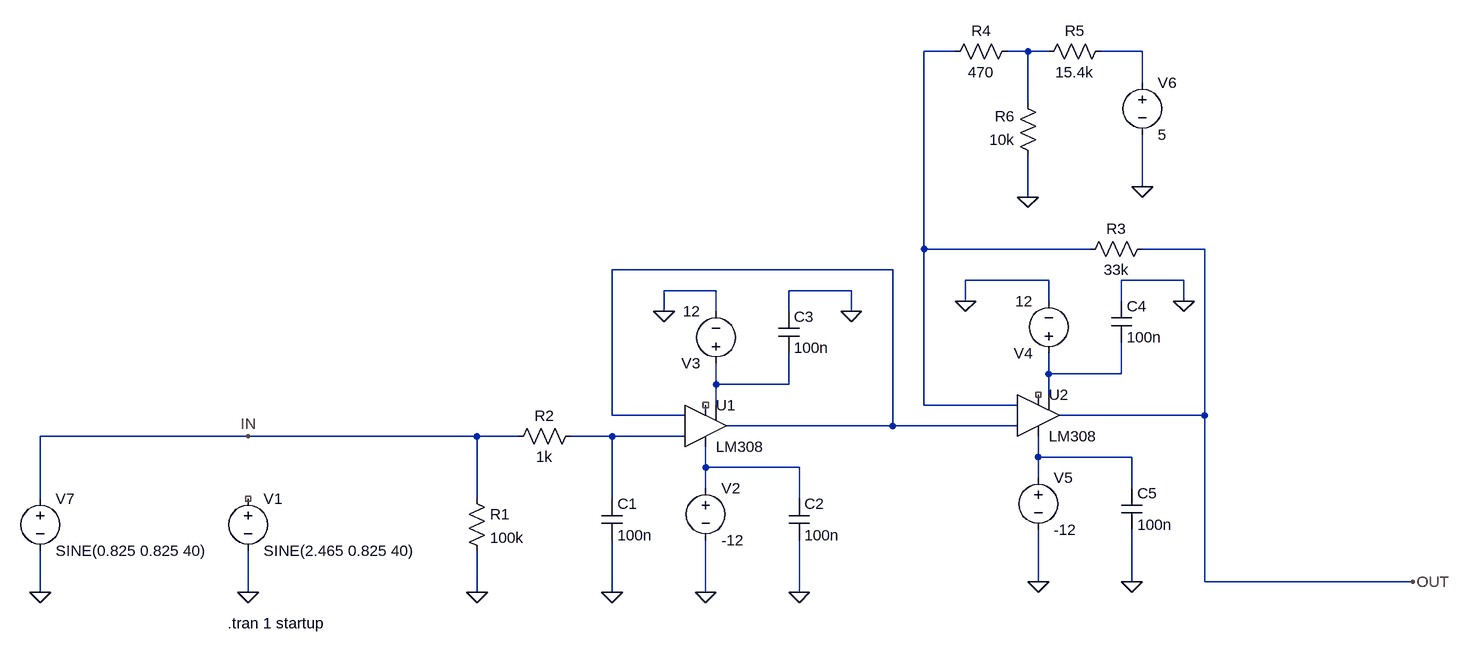
[diagram p0: schematic analog_output.asc]
analog_output.asc, the LTspice schematic file:
Version 4
SHEET 1 1656 680
WIRE 864 -560 816 -560
WIRE 976 -560 944 -560
WIRE 1008 -560 976 -560
WIRE 1152 -560 1088 -560
WIRE 1152 -512 1152 -560
WIRE 976 -480 976 -560
WIRE 1152 -352 1152 -432
WIRE 976 -336 976 -400
WIRE 816 -256 816 -560
WIRE 1072 -256 816 -256
WIRE 1248 -256 1152 -256
WIRE 768 -224 336 -224
WIRE 1008 -208 880 -208
WIRE 1216 -208 1120 -208
WIRE 496 -192 416 -192
WIRE 704 -192 608 -192
WIRE 880 -176 880 -208
WIRE 1008 -176 1008 -208
WIRE 1120 -176 1120 -208
WIRE 1216 -176 1216 -208
WIRE 416 -160 416 -192
WIRE 496 -160 496 -192
WIRE 608 -160 608 -192
WIRE 704 -160 704 -192
WIRE 1008 -64 1008 -96
WIRE 1120 -64 1120 -112
WIRE 1120 -64 1008 -64
WIRE 496 -48 496 -80
WIRE 608 -48 608 -96
WIRE 608 -48 496 -48
WIRE 1008 -32 1008 -64
WIRE 496 -16 496 -48
WIRE 816 -16 816 -256
WIRE 960 -16 816 -16
WIRE 336 0 336 -224
WIRE 448 0 336 0
WIRE 1248 0 1248 -256
WIRE 1248 0 1024 0
WIRE 768 16 768 -224
WIRE 768 16 512 16
WIRE 960 16 768 16
WIRE -224 32 -544 32
WIRE 128 32 -224 32
WIRE 192 32 128 32
WIRE 336 32 272 32
WIRE 448 32 336 32
WIRE 992 64 992 32
WIRE 1136 64 992 64
WIRE 480 80 480 48
WIRE 624 80 480 80
WIRE 992 96 992 64
WIRE 480 112 480 80
WIRE 1136 112 1136 64
WIRE -544 128 -544 32
WIRE 128 128 128 32
WIRE 336 128 336 32
WIRE 624 128 624 80
WIRE 992 256 992 176
WIRE 1136 256 1136 176
WIRE 1248 256 1248 0
WIRE 1568 256 1248 256
WIRE -544 272 -544 208
WIRE -224 272 -224 208
WIRE 128 272 128 208
WIRE 336 272 336 192
WIRE 480 272 480 192
WIRE 624 272 624 192
FLAG -224 272 0
FLAG 128 272 0
FLAG 336 272 0
FLAG 480 272 0
FLAG 624 272 0
FLAG 416 -160 0
FLAG 704 -160 0
FLAG 976 -336 0
FLAG 1568 256 OUT
FLAG 1216 -176 0
FLAG 880 -176 0
FLAG 992 256 0
FLAG 1136 256 0
FLAG 1152 -352 0
FLAG -224 32 IN
FLAG -544 272 0
SYMBOL voltage -224 112 R0
WINDOW 123 0 0 Left 0
WINDOW 39 0 0 Left 0
SYMATTR InstName V1
SYMATTR Value SINE(2.465 0.825 40)
SYMBOL res 112 112 R0
SYMATTR InstName R1
SYMATTR Value 100k
SYMBOL res 288 16 R90
WINDOW 0 0 56 VBottom 2
WINDOW 3 32 56 VTop 2
SYMATTR InstName R2
SYMATTR Value 1k
SYMBOL cap 320 128 R0
SYMATTR InstName C1
SYMATTR Value 100n
SYMBOL OpAmps\\LM308 480 -48 R0
SYMATTR InstName U1
SYMBOL voltage 480 96 R0
WINDOW 123 0 0 Left 0
WINDOW 39 0 0 Left 0
SYMATTR InstName V2
SYMATTR Value -12
SYMBOL cap 608 128 R0
SYMATTR InstName C2
SYMATTR Value 100n
SYMBOL voltage 496 -64 R180
WINDOW 123 0 0 Left 0
WINDOW 39 0 0 Left 0
SYMATTR InstName V3
SYMATTR Value 12
SYMBOL cap 592 -160 R0
SYMATTR InstName C3
SYMATTR Value 100n
SYMBOL OpAmps\\LM308 992 -64 R0
SYMATTR InstName U2
SYMBOL res 1168 -272 R90
WINDOW 0 0 56 VBottom 2
WINDOW 3 32 56 VTop 2
SYMATTR InstName R3
SYMATTR Value 33k
SYMBOL res 960 -576 R90
WINDOW 0 0 56 VBottom 2
WINDOW 3 32 56 VTop 2
SYMATTR InstName R4
SYMATTR Value 470
SYMBOL res 1104 -576 R90
WINDOW 0 0 56 VBottom 2
WINDOW 3 32 56 VTop 2
SYMATTR InstName R5
SYMATTR Value 15.4k
SYMBOL res 992 -384 R180
WINDOW 0 36 76 Left 2
WINDOW 3 36 40 Left 2
SYMATTR InstName R6
SYMATTR Value 10k
SYMBOL voltage 1008 -80 R180
WINDOW 123 0 0 Left 0
WINDOW 39 0 0 Left 0
SYMATTR InstName V4
SYMATTR Value 12
SYMBOL cap 1104 -176 R0
SYMATTR InstName C4
SYMATTR Value 100n
SYMBOL voltage 992 80 R0
WINDOW 123 0 0 Left 0
WINDOW 39 0 0 Left 0
SYMATTR InstName V5
SYMATTR Value -12
SYMBOL cap 1120 112 R0
SYMATTR InstName C5
SYMATTR Value 100n
SYMBOL voltage 1152 -528 R0
WINDOW 123 0 0 Left 0
WINDOW 39 0 0 Left 0
SYMATTR InstName V6
SYMATTR Value 5
SYMBOL voltage -544 112 R0
WINDOW 123 0 0 Left 0
WINDOW 39 0 0 Left 0
SYMATTR InstName V7
SYMATTR Value SINE(0.825 0.825 40)
TEXT -256 320 Left 2 !.tran 1 startup

The netlist it stands for:
* analog_output.asc
V1 NC_01 0 SINE(2.465 0.825 40)
R1 IN 0 100k
R2 N007 IN 1k
C1 N007 0 100n
XU1 N007 N004 N006 N009 N004 NC_02 NC_03 LT1008
V2 N009 0 -12
C2 N009 0 100n
V3 N006 0 12
C3 0 N006 100n
XU2 N004 N001 N005 N008 OUT NC_04 NC_05 LT1008
R3 OUT N001 33k
R4 N002 N001 470
R5 N003 N002 15.4k
R6 0 N002 10k
V4 N005 0 12
C4 0 N005 100n
V5 N008 0 -12
C5 N008 0 100n
V6 N003 0 5
V7 IN 0 SINE(0.825 0.825 40)
.tran 1 startup
.lib LTC.lib
.backanno
.end